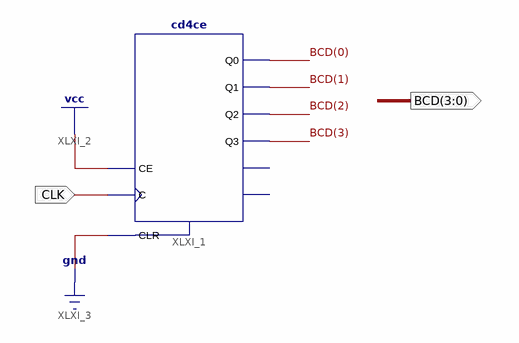
[diagram p0: schematic sheet 1]
// Xilinx ISE schematic BCDcounter.sch (spartan6) as structural Verilog: 1 symbols, 2 ports
module BCDcounter (
  input  CLK,
  output [3:0] BCD
);

  cd4ce XLXI_1 (.C(CLK), .CE(1'b1), .CLR(1'b0), .Q0(BCD[0]), .Q1(BCD[1]), .Q2(BCD[2]), .Q3(BCD[3]));  // open: CEO, TC
endmodule
